# Altium project Sensorhub.PrjPcb
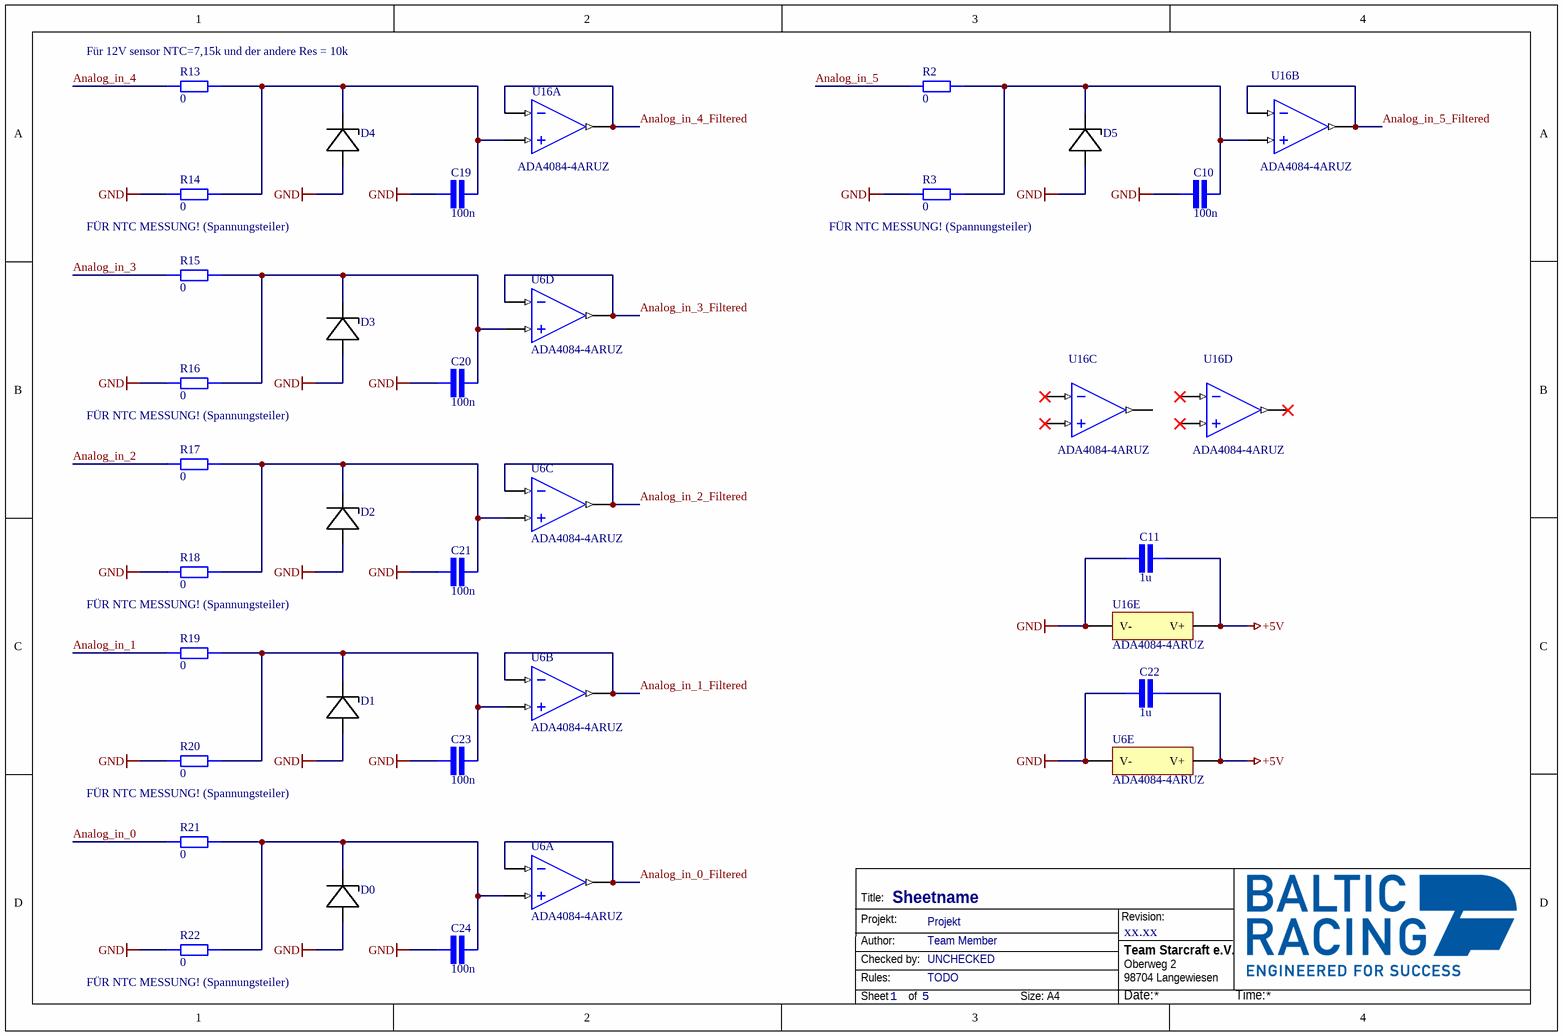
[diagram p0: analog filterung.SchDoc]
6 sheets, 106 parts. Net scope: global (net labels, ports and power ports of the same name join across sheets).
Board file: Sensorhub_PCB.PcbDoc
Sheets:
  analog filterung.SchDoc
  Connector.SchDoc
  Digital_Input.SchDoc
  main.SchDoc
  TYPK.SchDoc
  Table_for_Analog_In.SchDoc

## Sheet analog filterung.SchDoc: Sheetname
size A4; Date: 05.10.2017; CheckedBy: UNCHECKED; Author: Team Member; Organization: Team Starcraft e.V.; Address1: Oberweg 2; Address2: 98704 Langewiesen; Revision: xx.xx; SheetNumber: 1; SheetTotal: 5; Rules: TODO; ProjectName: Projekt

### Parts
C10  value 100n  [CAP 0603/1608]  (hidden comment: SMD Capacitor)
C11  value 1u  [CAP 0603/1608]  (hidden comment: SMD Capacitor)
C19  value 100n  [CAP 0603/1608]  (hidden comment: SMD Capacitor)
C20  value 100n  [CAP 0603/1608]  (hidden comment: SMD Capacitor)
C21  value 100n  [CAP 0603/1608]  (hidden comment: SMD Capacitor)
C22  value 1u  [CAP 0603/1608]  (hidden comment: SMD Capacitor)
C23  value 100n  [CAP 0603/1608]  (hidden comment: SMD Capacitor)
C24  value 100n  [CAP 0603/1608]  (hidden comment: SMD Capacitor)
D0  MMBZ4625-HE3-08  [SOT95P248X115-3N]  (value not drawn)
D1  MMBZ4625-HE3-08  [SOT95P248X115-3N]  (value not drawn)
D2  MMBZ4625-HE3-08  [SOT95P248X115-3N]  (value not drawn)
D3  MMBZ4625-HE3-08  [SOT95P248X115-3N]  (value not drawn)
D4  MMBZ4625-HE3-08  [SOT95P248X115-3N]  (value not drawn)
D5  MMBZ4625-HE3-08  [SOT95P248X115-3N]  (value not drawn)
R2  value 0  [STACKPOLE CSR0603]  (hidden comment: SMD Resistor)
R3  value 0  [STACKPOLE CSR0603]  (hidden comment: SMD Resistor)
R13  value 0  [STACKPOLE CSR0603]  (hidden comment: SMD Resistor)
R14  value 0  [STACKPOLE CSR0603]  (hidden comment: SMD Resistor)
R15  value 0  [STACKPOLE CSR0603]  (hidden comment: SMD Resistor)
R16  value 0  [STACKPOLE CSR0603]  (hidden comment: SMD Resistor)
R17  value 0  [STACKPOLE CSR0603]  (hidden comment: SMD Resistor)
R18  value 0  [STACKPOLE CSR0603]  (hidden comment: SMD Resistor)
R19  value 0  [STACKPOLE CSR0603]  (hidden comment: SMD Resistor)
R20  value 0  [STACKPOLE CSR0603]  (hidden comment: SMD Resistor)
R21  value 0  [STACKPOLE CSR0603]  (hidden comment: SMD Resistor)
R22  value 0  [STACKPOLE CSR0603]  (hidden comment: SMD Resistor)
U6  ADA4084-4ARUZ  [ANALOG_RU14]  (parts A,B,C,D,E of 5)
U16  ADA4084-4ARUZ  [ANALOG_RU14]  (parts A,B,C,D,E of 5)

### Nets
+5V: C11.1 C22.1 U6.4(V+) U16.4(V+)
GND: C10.1 C11.2 C19.1 C20.1 C21.1 C22.2 C23.1 C24.1 D0.A(Anode) D1.A(Anode) D2.A(Anode) D3.A(Anode) D4.A(Anode) D5.A(Anode) R3.2 R14.2 R16.2 R18.2 R20.2 R22.2 U6.11(V-) U16.11(V-)
Analog_in_0: R21.2
Analog_in_0_Filtered: U6.1(OUT_A) U6.2(-IN_A)
Analog_in_1: R19.2
Analog_in_1_Filtered: U6.6(-IN_B) U6.7(OUT_B)
Analog_in_2: R17.2
Analog_in_2_Filtered: U6.8(OUT_C) U6.9(-IN_C)
Analog_in_3: R15.2
Analog_in_3_Filtered: U6.13(-IN_D) U6.14(OUT_D)
Analog_in_4: R13.2
Analog_in_4_Filtered: U16.1(OUT_A) U16.2(-IN_A)
Analog_in_5: R2.2
Analog_in_5_Filtered: U16.6(-IN_B) U16.7(OUT_B)
NetC10_2: C10.2 D5.C(Kathode) R2.1 R3.1 U16.5(+IN_B)
NetC19_2: C19.2 D4.C(Kathode) R13.1 R14.1 U16.3(+IN_A)
NetC20_2: C20.2 D3.C(Kathode) R15.1 R16.1 U6.12(+IN_D)
NetC21_2: C21.2 D2.C(Kathode) R17.1 R18.1 U6.10(+IN_C)
NetC23_2: C23.2 D1.C(Kathode) R19.1 R20.1 U6.5(+IN_B)
NetC24_2: C24.2 D0.C(Kathode) R21.1 R22.1 U6.3(+IN_A)

Not connected (* = marked no-connect by the designer): U16 8(OUT_C) 9(-IN_C)* 10(+IN_C)* 12(+IN_D)* 13(-IN_D)* 14(OUT_D)*

### Notes on the sheet
- (near R13) Für 12V sensor NTC=7,15k und der andere Res = 10k
- FÜR NTC MESSUNG! (Spannungsteiler)
- (near R3) FÜR NTC MESSUNG! (Spannungsteiler)
- (near R22) FÜR NTC MESSUNG! (Spannungsteiler)
- Title:
- Projekt:
- Revision:
- Author:
- Rules:
- Checked by:
- Sheet
- of
- Size:
- A4
- Date:
- Time:

### Library data of the parts
C10 C11 C19-C24 = SMD Capacitor: Capacitor with multiple Footprints
D0-D5 = MMBZ4625-HE3-08: Zener-Diode 5.1 Volt 0.225W 5% AUTO; pin to pad: A>1 C>3; ComponentLink1Description: Mouser; ComponentLink1URL: https://www.mouser.de/ProductDetail/Vishay-Semiconductors/MMBZ4625-HE3-08?qs=ESFF34UzhwghTg091CfyaQ==; ComponentLink2Description: Datasheet; ComponentLink2URL: https://www.mouser.de/datasheet/2/427/VISH_S_A0006718872_1-2569675.pdf
R2 R3 R13-R22 = SMD Resistor: Resistor with multiple footprints
U6 U16 = ADA4084-4ARUZ: 30 V, Low Noise, Rail-to-Rail Input/Output, Low Power Operational Amplifiers

## Sheet Connector.SchDoc
size A3; SheetNumber: 2; SheetTotal: 5
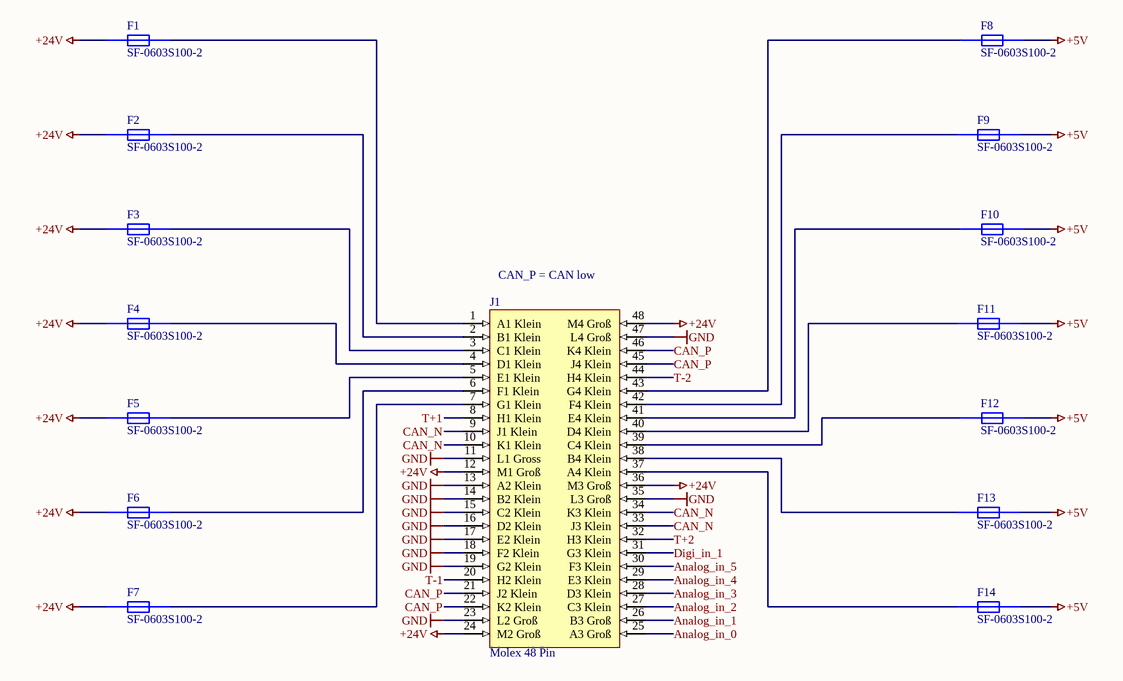
[diagram p1: Connector.SchDoc]

### Parts
F1  SF-0603S100-2  [RESC1608X06N]
F2  SF-0603S100-2  [RESC1608X06N]
F3  SF-0603S100-2  [RESC1608X06N]
F4  SF-0603S100-2  [RESC1608X06N]
F5  SF-0603S100-2  [RESC1608X06N]
F6  SF-0603S100-2  [RESC1608X06N]
F7  SF-0603S100-2  [RESC1608X06N]
F8  SF-0603S100-2  [RESC1608X06N]
F9  SF-0603S100-2  [RESC1608X06N]
F10  SF-0603S100-2  [RESC1608X06N]
F11  SF-0603S100-2  [RESC1608X06N]
F12  SF-0603S100-2  [RESC1608X06N]
F13  SF-0603S100-2  [RESC1608X06N]
F14  SF-0603S100-2  [RESC1608X06N]
J1  Molex 48 Pin  [5007621001]

### Nets
+5V: F8.2(A2) F9.2(A2) F10.2(A2) F11.2(A2) F12.2(A2) F13.2(A2) F14.2(A2)
+24V: F1.1(A1) F2.1(A1) F3.1(A1) F4.1(A1) F5.1(A1) F6.1(A1) F7.1(A1) J1.12(M1_Groß) J1.24(M2_Groß) J1.36(M3_Groß) J1.48(M4_Groß)
GND: J1.11(L1_Gross) J1.13(A2_Klein) J1.14(B2_Klein) J1.15(C2_Klein) J1.16(D2_Klein) J1.17(E2_Klein) J1.18(F2_Klein) J1.19(G2_Klein) J1.23(L2_Groß) J1.35(L3_Groß) J1.47(L4_Groß)
Analog_in_0: J1.25(A3_Groß)
Analog_in_1: J1.26(B3_Groß)
Analog_in_2: J1.27(C3_Klein)
Analog_in_3: J1.28(D3_Klein)
Analog_in_4: J1.29(E3_Klein)
Analog_in_5: J1.30(F3_Klein)
CAN_N: J1.9(J1_Klein) J1.10(K1_Klein) J1.33(J3_Klein) J1.34(K3_Klein)
CAN_P: J1.21(J2_Klein) J1.22(K2_Klein) J1.45(J4_Klein) J1.46(K4_Klein)
Digi_in_1: J1.31(G3_Klein)
T+1: J1.8(H1_Klein)
T+2: J1.32(H3_Klein)
T-1: J1.20(H2_Klein)
T-2: J1.44(H4_Klein)
NetF1_2: F1.2(A2) J1.1(A1_Klein)
NetF2_2: F2.2(A2) J1.2(B1_Klein)
NetF3_2: F3.2(A2) J1.3(C1_Klein)
NetF4_2: F4.2(A2) J1.4(D1_Klein)
NetF5_2: F5.2(A2) J1.5(E1_Klein)
NetF6_2: F6.2(A2) J1.6(F1_Klein)
NetF7_2: F7.2(A2) J1.7(G1_Klein)
NetF8_1: F8.1(A1) J1.43(G4_Klein)
NetF9_1: F9.1(A1) J1.42(F4_Klein)
NetF10_1: F10.1(A1) J1.41(E4_Klein)
NetF11_1: F11.1(A1) J1.40(D4_Klein)
NetF12_1: F12.1(A1) J1.39(C4_Klein)
NetF13_1: F13.1(A1) J1.38(B4_Klein)
NetF14_1: F14.1(A1) J1.37(A4_Klein)

### Notes on the sheet
- (near J1) CAN_P = CAN low

### Library data of the parts
F1-F14 = SF-0603S100-2: 0603 SMD Slow Blow Fuse; ComponentLink1Description: Mouser; ComponentLink1URL: https://www.mouser.de/ProductDetail/Bourns/SF-0603S100-2?qs=GIQXYiEeHGDLNhFbhYWnxw==; ComponentLink2Description: Datasheet; ComponentLink2URL: https://www.mouser.de/datasheet/2/54/sf0603s-777859.pdf
J1 = 5007621001: Molex 48 Pin CMC Header

## Sheet Digital_Input.SchDoc
size A3; SheetNumber: 3; SheetTotal: 5
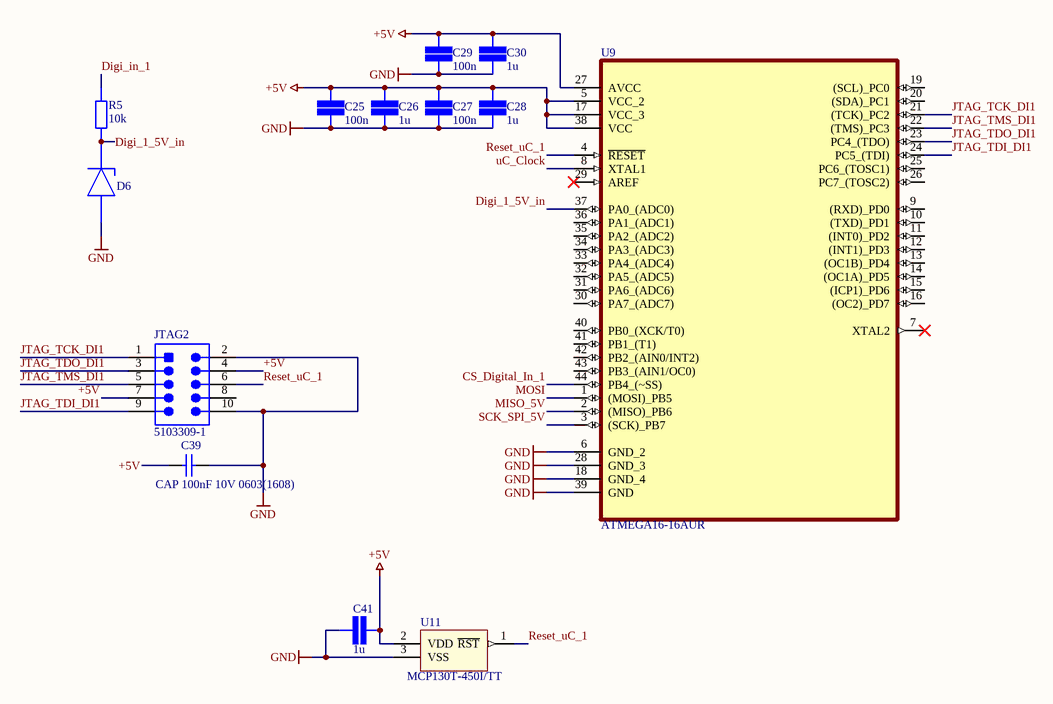
[diagram p2: Digital_Input.SchDoc]

### Parts
C25  value 100n  [CAP 0603/1608]  (hidden comment: SMD Capacitor)
C26  value 1u  [CAP 0603/1608]  (hidden comment: SMD Capacitor)
C27  value 100n  [CAP 0603/1608]  (hidden comment: SMD Capacitor)
C28  value 1u  [CAP 0603/1608]  (hidden comment: SMD Capacitor)
C29  value 100n  [CAP 0603/1608]  (hidden comment: SMD Capacitor)
C30  value 1u  [CAP 0603/1608]  (hidden comment: SMD Capacitor)
C39  CAP 100nF 10V 0603(1608)  [CAPC0603(1608)100_L]
C41  value 1u  [CAP 0603/1608]  (hidden comment: SMD Capacitor)
D6  MM3Z4V7T1G  [SOD-323-2]  (value not drawn)
JTAG2  5103309-1  [TECO-5103309-1_V]
R5  value 10k  [STACKPOLE CSR0603]  (hidden comment: SMD Resistor)
U9  ATMEGA16-16AUR  [QFP80P1200X1200X120-44N]
U11  MCP130T-450I/TT  [*SOT95P237X112-3N]

### Nets
+5V: C25.2 C26.2 C27.2 C28.2 C29.2 C30.2 C39.1 C41.1 JTAG2.4 JTAG2.7 U9.5(VCC_2) U9.17(VCC_3) U9.27(AVCC) U9.38(VCC) U11.2(VDD)
GND: C25.1 C26.1 C27.1 C28.1 C29.1 C30.1 C39.2 C41.2 D6.2A(A) JTAG2.2 JTAG2.10 U9.6(GND_2) U9.18(GND_4) U9.28(GND_3) U9.39(GND) U11.3(VSS)
CS_Digital_In_1: U9.44(PB4_(~SS))
Digi_1_5V_in: D6.1C(C) R5.2 U9.37(PA0_(ADC0))
Digi_in_1: R5.1
JTAG_TCK_DI1: JTAG2.1 U9.21((TCK)_PC2)
JTAG_TDI_DI1: JTAG2.9 U9.24(PC5_(TDI))
JTAG_TDO_DI1: JTAG2.3 U9.23(PC4_(TDO))
JTAG_TMS_DI1: JTAG2.5 U9.22((TMS)_PC3)
MISO_5V: U9.2((MISO)_PB6)
MOSI: U9.1((MOSI)_PB5)
Reset_uC_1: JTAG2.6 U9.4(~{RESET}) U11.1(~{RST})
SCK_SPI_5V: U9.3((SCK)_PB7)
uC_Clock: U9.8(XTAL1)

Not connected (* = marked no-connect by the designer): JTAG2 8; U9 7(XTAL2)* 9((RXD)_PD0) 10((TXD)_PD1) 11((INT0)_PD2) 12((INT1)_PD3) 13((OC1B)_PD4) 14((OC1A)_PD5) 15((ICP1)_PD6) 16((OC2)_PD7) 19((SCL)_PC0) 20((SDA)_PC1) 25(PC6_(TOSC1)) 26(PC7_(TOSC2)) 29(AREF)* 30(PA7_(ADC7)) 31(PA6_(ADC6)) 32(PA5_(ADC5)) 33(PA4_(ADC4)) 34(PA3_(ADC3)) 35(PA2_(ADC2)) 36(PA1_(ADC1)) 40(PB0_(XCK/T0)) 41(PB1_(T1)) 42(PB2_(AIN0/INT2)) 43(PB3_(AIN1/OC0))

### Library data of the parts
C25-C30 C41 = SMD Capacitor: Capacitor with multiple Footprints
C39 = CMP-1035-02579-1: CAP 100nF 10V ±5% 0603 (1608 Metric) Thickness 1mm SMD; Tolerance: Â±5%; Case-EIA: 0603; Case-Metric: 1608; Value: 100nF; Max Thickness: 1 mm; Rated Voltage: 10 V; Technology: SMT
D6 = MM3Z4V7T1G: onsemi MM3Z4V7T1G / Z-Diode, 4,7V; ComponentLink1Description: Octopart; ComponentLink1URL: https://octopart.com/mm3z4v7t1g-onsemi-331144?r=sp
JTAG2 = CMP-2000-07502-1: Male Header, Pitch 2.54 mm, 2 x 5 Position, Height 9.855 mm, Tail Length 3.048 mm, -65 to 105 degC, RoHS, Tube; Manufacturer: TE Connectivity; PCB Mounting Orientation: Vertical; Pitch: 2.54mm; Mating Connector Lock: No(Without); Body Material: Thermoplastic; Shrouded: Yes(With); Connector System: Wire-to-Board; Insulation Resistance: 5GR; Number of Positions: 10; Max Current Rating: 1A; PCB Mount Retention: Without; Manufacturer URL: http://www.te.com/; Contact Plating: Gold; Datasheet URL: http://www.te.com/commerce/DocumentDelivery/DDEController?Action=showdoc&DocId=Customer+Drawing%7F5103309%7FE1%7Fpdf%7FEnglish%7FENG_CD_5103309_E1.pdf%7F5103309-1; Colour: Black; Termination: ThroughHole; Housing Colour: Black; Flammability Rating: UL94V-0; Package Description: Male Header, Pitch 2.54 mm, 2 x 5 Position, Height 9.855 mm, Tail Length 3.048 mm; Mating Retention: No(Without); Orientation: Straight; Row Spacing: 2.54mm; Termination Post Length: 0.12inch; Min Operating Temperature: -65degC; Board Standoff: Yes(With); REACH SVHC: NoSVHC; Depth: 9.14mm; Lead Free: LeadFree; Gender: Male; Connector Type: Header; Shrouded End Dimension: 3.81mm; ELV: Compliant; Mating Alignment: Yes(With); Panel Mount Retention: No(Without); Package Quantity: 35; PCB Mount Alignment: No(Without); Number of Rows: 2; Package Reference: 5103309-1; Mounting Technology: ThroughHole; Mount: ThroughHole; Contact Gender: Male; Number of Contacts: 10; Length: 0.8inch; Current Rating: 1A; Contact Mating Length: 0.24inch; Max Operating Temperature: 105degC; RoHSCompliant: True; Datasheet Version: Rev. E1, 03/2011; Contact Shape: Square; Height: 8.813mm; Housing Material: PBT; Contact Material: CopperAlloy; Packaging: Rail/Tube
R5 = SMD Resistor: Resistor with multiple footprints
U9 = ATMEGA16-16AUR: 8-bit Microcontroller; Package: None; Price: None; Value: *; MP: ATMEGA16-16AUR; Availability: Unavailable
U11 = MCP130T-450I/TT: System Supervisors - Power Supply Monitors with Reset Generators Open Drain Low; MF: Microchip; MP: MCP120T-450I/TT; Price: None; SnapEDA_Link: https://www.snapeda.com/parts/MCP120T-450I/TT/Microchip/view-part/?ref=snap; Package: SOT-23-3 Microchip; Availability: Unavailable; Value: *

## Sheet main.SchDoc: Main Sebnsorhub
size A4; Date: 27.09.2020; CheckedBy: UNCHECKED; Author: Eric Gorkow/Lukas Deeken; DrawnBy: Baltic Racing; Organization: Team Starcraft e.V.; Address1: Oberweg 2; Address2: 98704 Langewiesen; DocumentNumber: 1; Revision: 2.2; SheetNumber: 4; SheetTotal: 5; Rules: TODO; ProjectName: Projekt
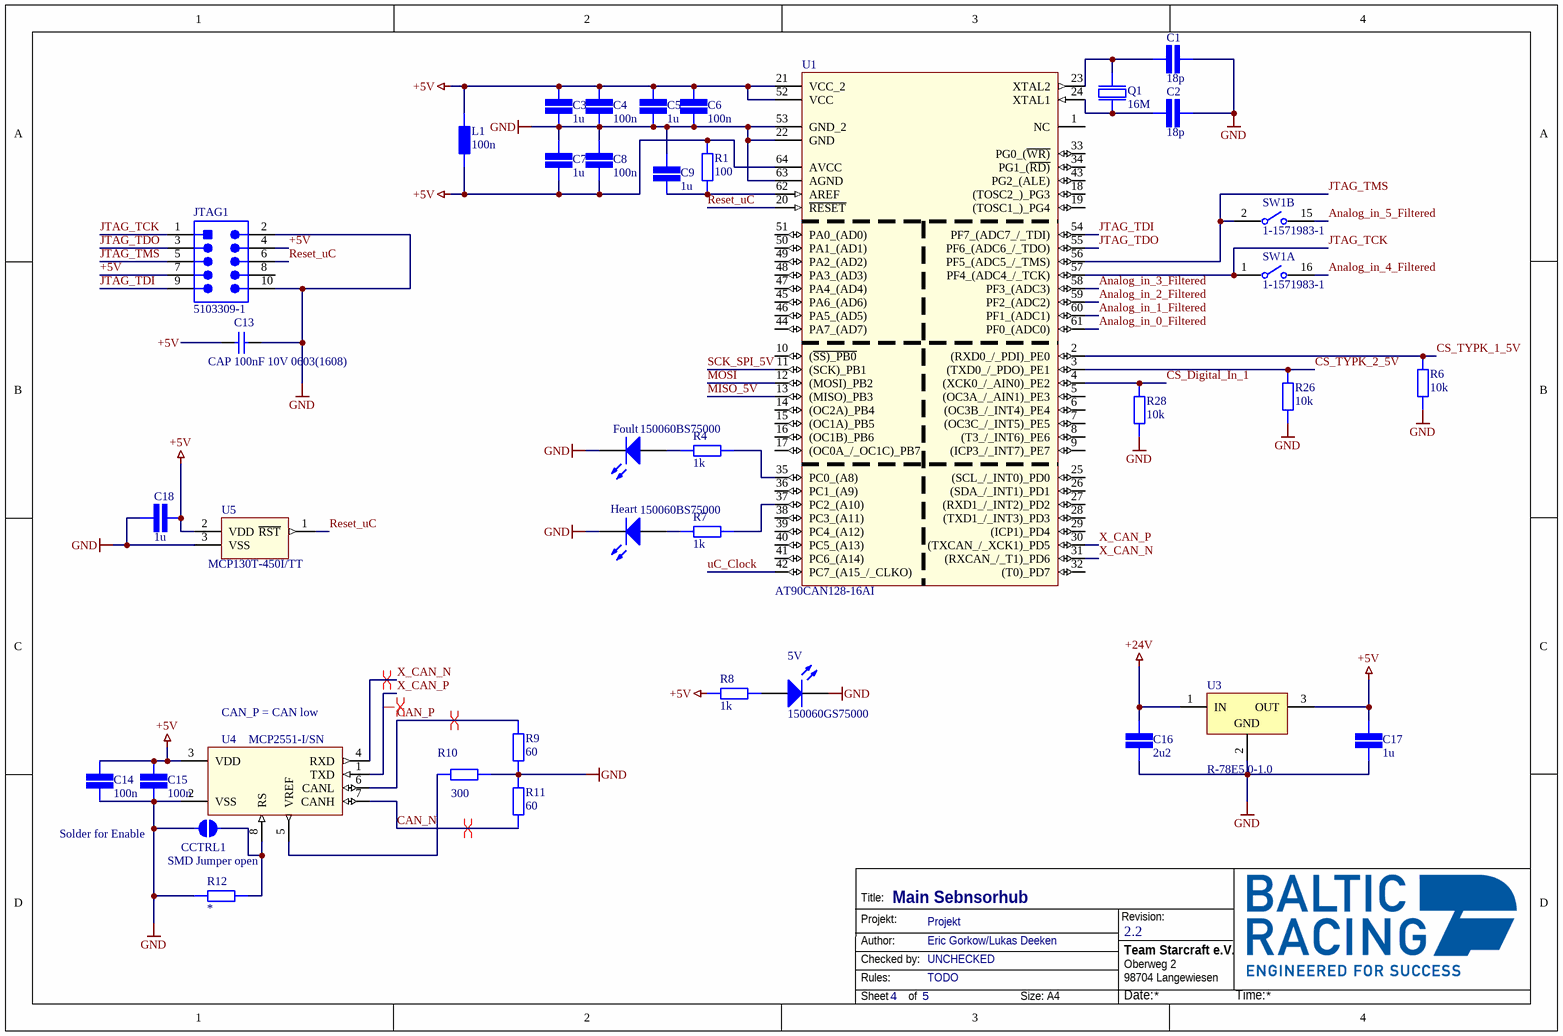
[diagram p3: main.SchDoc]

### Parts
5V  150060GS75000  [0603_A]
C1  value 18p  [CAP 0603/1608]  (hidden comment: SMD Capacitor)
C2  value 18p  [CAP 0603/1608]  (hidden comment: SMD Capacitor)
C3  value 1u  [CAP 0603/1608]  (hidden comment: SMD Capacitor)
C4  value 100n  [CAP 0603/1608]  (hidden comment: SMD Capacitor)
C5  value 1u  [CAP 0603/1608]  (hidden comment: SMD Capacitor)
C6  value 100n  [CAP 0603/1608]  (hidden comment: SMD Capacitor)
C7  value 1u  [CAP 0603/1608]  (hidden comment: SMD Capacitor)
C8  value 100n  [CAP 0603/1608]  (hidden comment: SMD Capacitor)
C9  value 1u  [CAP 0603/1608]  (hidden comment: SMD Capacitor)
C13  CAP 100nF 10V 0603(1608)  [CAPC0603(1608)100_L]
C14  value 100n  [CAP 0603/1608]  (hidden comment: SMD Capacitor)
C15  value 100n  [CAP 0603/1608]  (hidden comment: SMD Capacitor)
C16  value 2u2  [CAP 0603/1608]  (hidden comment: SMD Capacitor)
C17  value 1u  [CAP 0603/1608]  (hidden comment: SMD Capacitor)
C18  value 1u  [CAP 0603/1608]  (hidden comment: SMD Capacitor)
CCTRL1  SMD Jumper open  [SMD-JUMPER-OPEN]  (no BOM)
Foult  150060BS75000  [0603_A]
Heart  150060BS75000  [0603_A]
JTAG1  5103309-1  [TECO-5103309-1_V]
L1  value 100n  [STACKPOLE CSR0603]  (hidden comment: SMD Inductor)
Q1  16M  [NDK NX5032GA]
R1  value 100  [STACKPOLE CSR0603]  (hidden comment: SMD Resistor)
R4  value 1k  [STACKPOLE CSR0603]  (hidden comment: 0603 220)
R6  value 10k  [STACKPOLE CSR0603]  (hidden comment: SMD Resistor)
R7  value 1k  [STACKPOLE CSR0603]  (hidden comment: 0603 220)
R8  value 1k  [STACKPOLE CSR0603]  (hidden comment: 0603 220)
R9  value 60  [STACKPOLE CSR0603]  (hidden comment: SMD Resistor)
R10  value 300  [STACKPOLE CSR0603]  (hidden comment: SMD Resistor)
R11  value 60  [STACKPOLE CSR0603]  (hidden comment: SMD Resistor)
R12  SMD Resistor  [STACKPOLE CSR0603]  (value not drawn)
R26  value 10k  [STACKPOLE CSR0603]  (hidden comment: SMD Resistor)
R28  value 10k  [STACKPOLE CSR0603]  (hidden comment: SMD Resistor)
SW1  1-1571983-1  [FP-1-1571983-1-MFG]  (parts A,B of 8)
U1  AT90CAN128-16AI  [*QFP80P1600X1600X120-64N]
U3  R-78E5.0-1.0  [SIP3_RECOM]
U4  MCP2551-I/SN  [*SOIC127P600X175-8N]
U5  MCP130T-450I/TT  [*SOT95P237X112-3N]

### Nets
+5V: C3.2 C4.2 C5.2 C6.2 C7.1 C8.1 C13.1 C14.2 C15.2 C17.2 C18.1 JTAG1.4 JTAG1.7 L1.1 L1.2 R1.2 R8.1 U1.21(VCC_2) U1.52(VCC) U1.64(AVCC) U3.3(OUT) U4.3(VDD) U5.2(VDD)
+24V: C16.2 U3.1(IN)
GND: 5V.1(K) C1.1 C2.1 C3.1 C4.1 C5.1 C6.1 C7.2 C8.2 C9.2 C13.2 C14.1 C15.1 C16.1 C17.1 C18.2 CCTRL1.1 Foult.1(K) Heart.1(K) JTAG1.2 JTAG1.10 R6.1 R9.2 R10.2 R11.1 R12.1 R26.1 R28.1 U1.22(GND) U1.53(GND_2) U1.63(AGND) U3.2(GND) U4.2(VSS) U5.3(VSS)
Analog_in_0_Filtered: U1.61(PF0_(ADC0))
Analog_in_1_Filtered: U1.60(PF1_(ADC1))
Analog_in_2_Filtered: U1.59(PF2_(ADC2))
Analog_in_3_Filtered: U1.58(PF3_(ADC3))
Analog_in_4_Filtered: SW1.16
Analog_in_5_Filtered: SW1.15
CAN_N: R11.2 U4.7(CANH)
CAN_P: R9.1 U4.6(CANL)
CS_Digital_In_1: R28.2 U1.4((XCK0_/_AIN0)_PE2)
CS_TYPK_1_5V: R6.2 U1.2((RXD0_/_PDI)_PE0)
CS_TYPK_2_5V: R26.2 U1.3((TXD0_/_PDO)_PE1)
JTAG_TCK: JTAG1.1 SW1.1 U1.57(PF4_(ADC4_/_TCK))
JTAG_TDI: JTAG1.9 U1.54(PF7_(ADC7_/_TDI))
JTAG_TDO: JTAG1.3 U1.55(PF6_(ADC6_/_TDO))
JTAG_TMS: JTAG1.5 SW1.2 U1.56(PF5_(ADC5_/_TMS))
MISO_5V: U1.13((MISO)_PB3)
MOSI: U1.12((MOSI)_PB2)
Reset_uC: JTAG1.6 U1.20(~{RESET}) U5.1(~{RST})
SCK_SPI_5V: U1.11((SCK)_PB1)
uC_Clock: U1.42(PC7_(A15_/_CLKO))
X_CAN_N: U1.31((RXCAN_/_T1)_PD6) U4.4(RXD)
X_CAN_P: U1.30((TXCAN_/_XCK1)_PD5) U4.1(TXD)
Net5V_2: 5V.2(A) R8.2
NetC1_2: C1.2 Q1.2 U1.23(XTAL2)
NetC2_2: C2.2 Q1.1 U1.24(XTAL1)
NetC9_1: C9.1 R1.1 U1.62(AREF)
NetCCTRL1_2: CCTRL1.2 R12.2 U4.8(RS)
NetFoult_2: Foult.2(A) R4.1
NetHeart_2: Heart.2(A) R7.1
NetR4_2: R4.2 U1.35(PC0_(A8))
NetR7_2: R7.2 U1.37(PC2_(A10))
NetR10_1: R10.1 U4.5(VREF)

Not connected (* = marked no-connect by the designer): JTAG1 8; U1 1(NC) 5((OC3A_/_AIN1)_PE3) 6((OC3B_/_INT4)_PE4) 7((OC3C_/_INT5)_PE5) 8((T3_/_INT6)_PE6) 9((ICP3_/_INT7)_PE7) 10((~{SS)_PB0}) 14((OC2A)_PB4) 15((OC1A)_PB5) 16((OC1B)_PB6) 17((OC0A_/_OC1C)_PB7) 18((TOSC2_)_PG3) 19((TOSC1_)_PG4) 25((SCL_/_INT0)_PD0) 26((SDA_/_INT1)_PD1) 27((RXD1_/_INT2)_PD2) 28((TXD1_/_INT3)_PD3) 29((ICP1)_PD4) 32((T0)_PD7) 33(PG0_(~{WR)}) 34(PG1_(~{RD)}) 36(PC1_(A9)) 38(PC3_(A11)) 39(PC4_(A12)) 40(PC5_(A13)) 41(PC6_(A14)) 43(PG2_(ALE)) 44(PA7_(AD7)) 45(PA6_(AD6)) 46(PA5_(AD5)) 47(PA4_(AD4)) 48(PA3_(AD3)) 49(PA2_(AD2)) 50(PA1_(AD1)) 51(PA0_(AD0))

### Layout directives
differential pair: CAN_N, CAN_P, X_CAN_N, X_CAN_P

### Notes on the sheet
- (near U4) CAN_P = CAN low
- Solder for Enable
- Title:
- Projekt:
- Revision:
- Author:
- Rules:
- Checked by:
- Sheet
- of
- Size:
- A4
- Date:
- Time:

### Library data of the parts
5V = CMP-1426-00002-1: SMD mono-color Chip LED, WL-SMCW, Green; Manufacturer: Wuerth Elektronik; ComponentLink1URL: http://www.we-online.com; ComponentLink2Description: Datasheet; Color: Green; ComponentLink2URL: http://katalog.we-online.com/led/datasheet/150060GS75000.pdf; PartNumber: 150060GS75000; PackageReference: 0603_A; ComponentLink1Description: Manufacturer URL
C1-C9 C14-C18 = SMD Capacitor: Capacitor with multiple Footprints
C13 = CMP-1035-02579-1: as C39 on sheet Digital_Input; Value: 100nF; Max Thickness: 1 mm; Rated Voltage: 10 V; Technology: SMT
Foult Heart = CMP-1426-00003-1: SMD mono-color Chip LED, WL-SMCW, Blue; Manufacturer: Wuerth Elektronik; Color: Blue; ComponentLink2Description: Datasheet; ComponentLink2URL: http://katalog.we-online.com/led/datasheet/150060BS75000.pdf; ComponentLink1URL: http://www.we-online.com; PackageReference: 0603_A; PartNumber: 150060BS75000; ComponentLink1Description: Manufacturer URL
JTAG1 = CMP-2000-07502-1: as JTAG2 on sheet Digital_Input; Manufacturer URL: http://www.te.com/; Contact Plating: Gold; Datasheet URL: http://www.te.com/commerce/DocumentDelivery/DDEController?Action=showdoc&DocId=Customer+Drawing%7F5103309%7FE1%7Fpdf%7FEnglish%7FENG_CD_5103309_E1.pdf%7F5103309-1; Colour: Black; Termination: ThroughHole; Housing Colour: Black; Flammability Rating: UL94V-0; Package Description: Male Header, Pitch 2.54 mm, 2 x 5 Position, Height 9.855 mm, Tail Length 3.048 mm; Mating Retention: No(Without); Orientation: Straight; Row Spacing: 2.54mm; Termination Post Length: 0.12inch; Min Operating Temperature: -65degC; Board Standoff: Yes(With); REACH SVHC: NoSVHC; Depth: 9.14mm; Lead Free: LeadFree; Gender: Male; Connector Type: Header; Shrouded End Dimension: 3.81mm; ELV: Compliant; Mating Alignment: Yes(With); Panel Mount Retention: No(Without); Package Quantity: 35; PCB Mount Alignment: No(Without); Number of Rows: 2; Package Reference: 5103309-1; Mounting Technology: ThroughHole; Mount: ThroughHole; Contact Gender: Male; Number of Contacts: 10; Length: 0.8inch; Current Rating: 1A; Contact Mating Length: 0.24inch; Max Operating Temperature: 105degC; RoHSCompliant: True; Datasheet Version: Rev. E1, 03/2011; Contact Shape: Square; Height: 8.813mm; Housing Material: PBT; Contact Material: CopperAlloy; Packaging: Rail/Tube
Q1 = 16 MHz Quartz
R1 R4 R6-R12 R26 R28 = SMD Resistor: Resistor with multiple footprints
  R12: Value: *
SW1 = CMP-03400-000003-1: SWITCH SLIDE DIP SPST 25MA 24V; Manufacturer: TE Connectivity; Standoff Height: 0mm; Contact Resistance: 100mΩ; Voltage Rating Dc: 50V; Electromechanical Life: 1000Cycles; Number Of Circuits: 8; Temperature: -30°C to +85°C; Mouser Description: Switch DIP OFF ON SPST 8 Recessed Rocker 0.025A 24VDC Gull Wing 1.27mm SMD T/R; Temperature Range High: +85°C; Manufacturer Part Number: 1-1571983-1; Contact Current Rating: 25mA; Device Class L2: Switches; ComponentLink2Description: Datasheet; Category: Switch; ComponentLink2URL: https://www.te.com/commerce/DocumentDelivery/DDEController?Action=showdoc&DocId=Catalog+Section%7F1308111-1_SWITCHES_CORE_PROGRAM_CATALOG%7F0308%7Fpdf%7FEnglish%7FENG_CS_1308111-1_SWITCHES_CORE_PROGRAM_CATALOG_0308.pdf%7F1-1571983-1; Octopart: https://octopart.com/1-1571983-1-te+connectivity-40115518; Footprint Url: https://www.te.com/commerce/DocumentDelivery/DDEController?Action=showdoc&DocId=Customer+Drawing%7F1571983%7FC6%7Fpdf%7FEnglish%7FENG_CD_1571983_C6.pdf%7F1-1571983-1; Digikey Description: SWITCH SLIDE DIP SPST 25MA 24V; Device Class L3: DIP Switches; Mount: Surface Mount; Throw Configuration: SPST; RoHS: TRUE; Lead Free: Yes; Temperature Range Low: -30°C; Height: 2.56mm; Device Class L1: Electromechanical; Package: 1-1571983-1; Automotive: No
U1 = AT90CAN128-16AI: Ic Mcu 8bit 128kb Flash 64tqfp; MF: Microchip; MP: AT90CAN128-16AI; Package: TQFP-64 Microchip; SnapEDA_Link: https://www.snapeda.com/parts/AT90CAN128-16AI/Microchip/view-part/?ref=snap; Price: None; Availability: Unavailable; Value: *
U3 = R-78E05-1.0: Nonisolated 5V Switchmode converter
U4 = MCP2551-I/SN: MCP2551 Series 5.5 V 1 Mb/s Surface Mount High-Speed CAN Transceiver - SOIC-8; MF: Microchip; MP: MCP2551-I/SN; SnapEDA_Link: https://www.snapeda.com/parts/MCP2551-I/SN/Microchip/view-part/?ref=snap; Price: None; Package: SOIC-8 Microchip; Availability: Unavailable; Value: *
U5 = MCP130T-450I/TT: as U11 on sheet Digital_Input; Price: None; SnapEDA_Link: https://www.snapeda.com/parts/MCP120T-450I/TT/Microchip/view-part/?ref=snap; Package: SOT-23-3 Microchip; Availability: Unavailable; Value: *

## Sheet TYPK.SchDoc
size A3; SheetNumber: 5; SheetTotal: 5
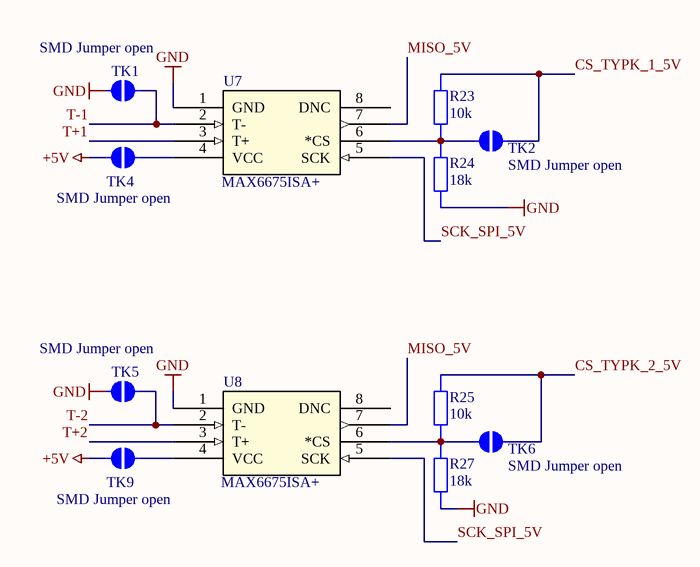
[diagram p4: TYPK.SchDoc]

### Parts
R23  value 10k  [STACKPOLE CSR0603]  (hidden comment: SMD Resistor)
R24  value 18k  [STACKPOLE CSR0603]  (hidden comment: SMD Resistor)
R25  value 10k  [STACKPOLE CSR0603]  (hidden comment: SMD Resistor)
R27  value 18k  [STACKPOLE CSR0603]  (hidden comment: SMD Resistor)
TK1  SMD Jumper open  [SMD-JUMPER-OPEN]  (no BOM)
TK2  SMD Jumper open  [SMD-JUMPER-OPEN]  (no BOM)
TK4  SMD Jumper open  [SMD-JUMPER-OPEN]  (no BOM)
TK5  SMD Jumper open  [SMD-JUMPER-OPEN]  (no BOM)
TK6  SMD Jumper open  [SMD-JUMPER-OPEN]  (no BOM)
TK9  SMD Jumper open  [SMD-JUMPER-OPEN]  (no BOM)
U7  MAX6675ISA+  [SOIC8]
U8  MAX6675ISA+  [SOIC8]

### Nets
+5V: TK4.1 TK9.1
GND: R24.1 R27.1 TK1.1 TK5.1 U7.1(GND) U8.1(GND)
CS_TYPK_1_5V: R23.2 TK2.2
CS_TYPK_2_5V: R25.2 TK6.2
MISO_5V: U7.7(SO) U8.7(SO)
SCK_SPI_5V: U7.5(SCK) U8.5(SCK)
T+1: U7.3(T+)
T+2: U8.3(T+)
T-1: TK1.2 U7.2(T-)
T-2: TK5.2 U8.2(T-)
NetR23_1: R23.1 R24.2 TK2.1 U7.6(*CS)
NetR25_1: R25.1 R27.2 TK6.1 U8.6(*CS)
NetTK4_2: TK4.2 U7.4(VCC)
NetTK9_2: TK9.2 U8.4(VCC)

Not connected (* = marked no-connect by the designer): U7 8(DNC); U8 8(DNC)

### Library data of the parts
R23-R25 R27 = SMD Resistor: Resistor with multiple footprints
U7 U8 = MAX31855KASA+: No Description Available; Vendor: Maxim Integrated Products; Built_By: EMA_UL_Team; Manufacturer_Part_Number: MAX31855KASA+; Copyright: Copyright (C) 2018 Accelerated Designs. All rights reserved; RefDes: RefDes; Type: DEV; Value: Value

## Sheet Table_for_Analog_In.SchDoc
size A4; SheetNumber: 6; SheetTotal: 6
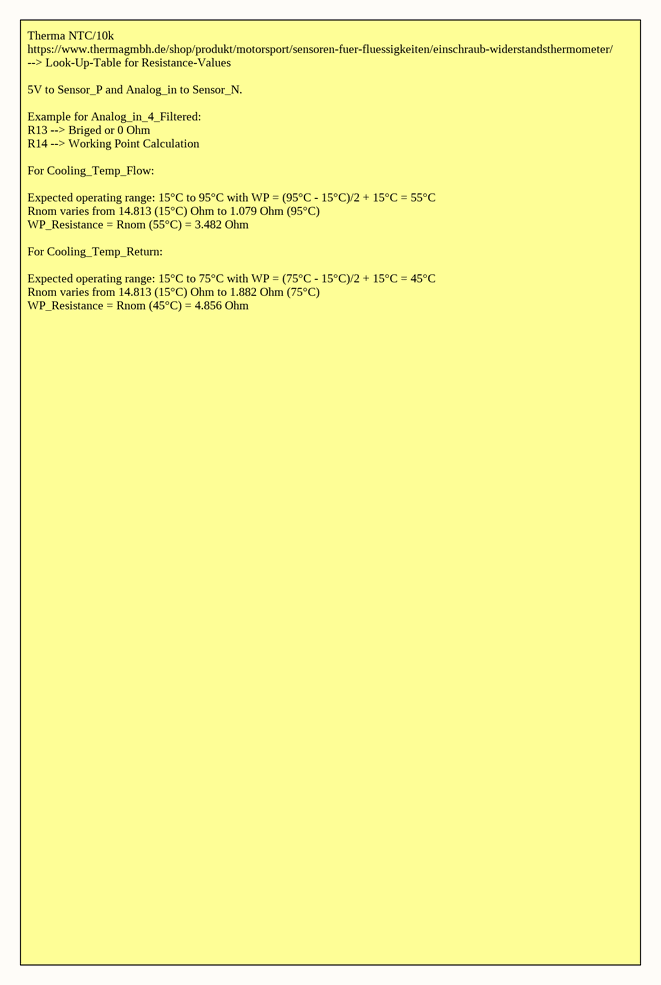
[diagram p5: Table_for_Analog_In.SchDoc]

### Notes on the sheet
- Therma NTC/10k
  https://www.thermagmbh.de/shop/produkt/motorsport/sensoren-fuer-fluessigkeiten/einschraub-widerstandsthermometer/
  --> Look-Up-Table for Resistance-Values
  5V to Sensor_P and Analog_in to Sensor_N.
  Example for Analog_in_4_Filtered:
  R13 --> Briged or 0 Ohm
  R14 --> Working Point Calculation
  For Cooling_Temp_Flow:
  Expected operating range: 15°C to 95°C with WP = (95°C - 15°C)/2 + 15°C = 55°C
  Rnom varies from 14.813 (15°C) Ohm to 1.079 Ohm (95°C)
  WP_Resistance = Rnom (55°C) = 3.482 Ohm
  For Cooling_Temp_Return:
  Expected operating range: 15°C to 75°C with WP = (75°C - 15°C)/2 + 15°C = 45°C
  Rnom varies from 14.813 (15°C) Ohm to 1.882 Ohm (75°C)
  WP_Resistance = Rnom (45°C) = 4.856 Ohm

## Nets that join several sheets
+5V: analog filterung (C11.1 C22.1 U6.4 U16.4), Connector (7 pins), Digital_Input (15 pins), main (23 pins), TYPK (TK4.1 TK9.1)
+24V: Connector (11 pins), main (C16.2 U3.1)
GND: analog filterung (22 pins), Connector (11 pins), Digital_Input (16 pins), main (34 pins), TYPK (6 pins)
Analog_in_0: analog filterung (R21.2), Connector (J1.25)
Analog_in_0_Filtered: analog filterung (U6.1 U6.2), main (U1.61)
Analog_in_1: analog filterung (R19.2), Connector (J1.26)
Analog_in_1_Filtered: analog filterung (U6.6 U6.7), main (U1.60)
Analog_in_2: analog filterung (R17.2), Connector (J1.27)
Analog_in_2_Filtered: analog filterung (U6.8 U6.9), main (U1.59)
Analog_in_3: analog filterung (R15.2), Connector (J1.28)
Analog_in_3_Filtered: analog filterung (U6.13 U6.14), main (U1.58)
Analog_in_4: analog filterung (R13.2), Connector (J1.29)
Analog_in_4_Filtered: analog filterung (U16.1 U16.2), main (SW1.16)
Analog_in_5: analog filterung (R2.2), Connector (J1.30)
Analog_in_5_Filtered: analog filterung (U16.6 U16.7), main (SW1.15)
CAN_N: Connector (J1.9 J1.10 J1.33 J1.34), main (R11.2 U4.7)
CAN_P: Connector (J1.21 J1.22 J1.45 J1.46), main (R9.1 U4.6)
CS_Digital_In_1: Digital_Input (U9.44), main (R28.2 U1.4)
CS_TYPK_1_5V: main (R6.2 U1.2), TYPK (R23.2 TK2.2)
CS_TYPK_2_5V: main (R26.2 U1.3), TYPK (R25.2 TK6.2)
Digi_in_1: Connector (J1.31), Digital_Input (R5.1)
MISO_5V: Digital_Input (U9.2), main (U1.13), TYPK (U7.7 U8.7)
MOSI: Digital_Input (U9.1), main (U1.12)
SCK_SPI_5V: Digital_Input (U9.3), main (U1.11), TYPK (U7.5 U8.5)
T+1: Connector (J1.8), TYPK (U7.3)
T+2: Connector (J1.32), TYPK (U8.3)
T-1: Connector (J1.20), TYPK (TK1.2 U7.2)
T-2: Connector (J1.44), TYPK (TK5.2 U8.2)
uC_Clock: Digital_Input (U9.8), main (U1.42)